# EAGLE design mega_shield_simple (EAGLE 7.6.0)
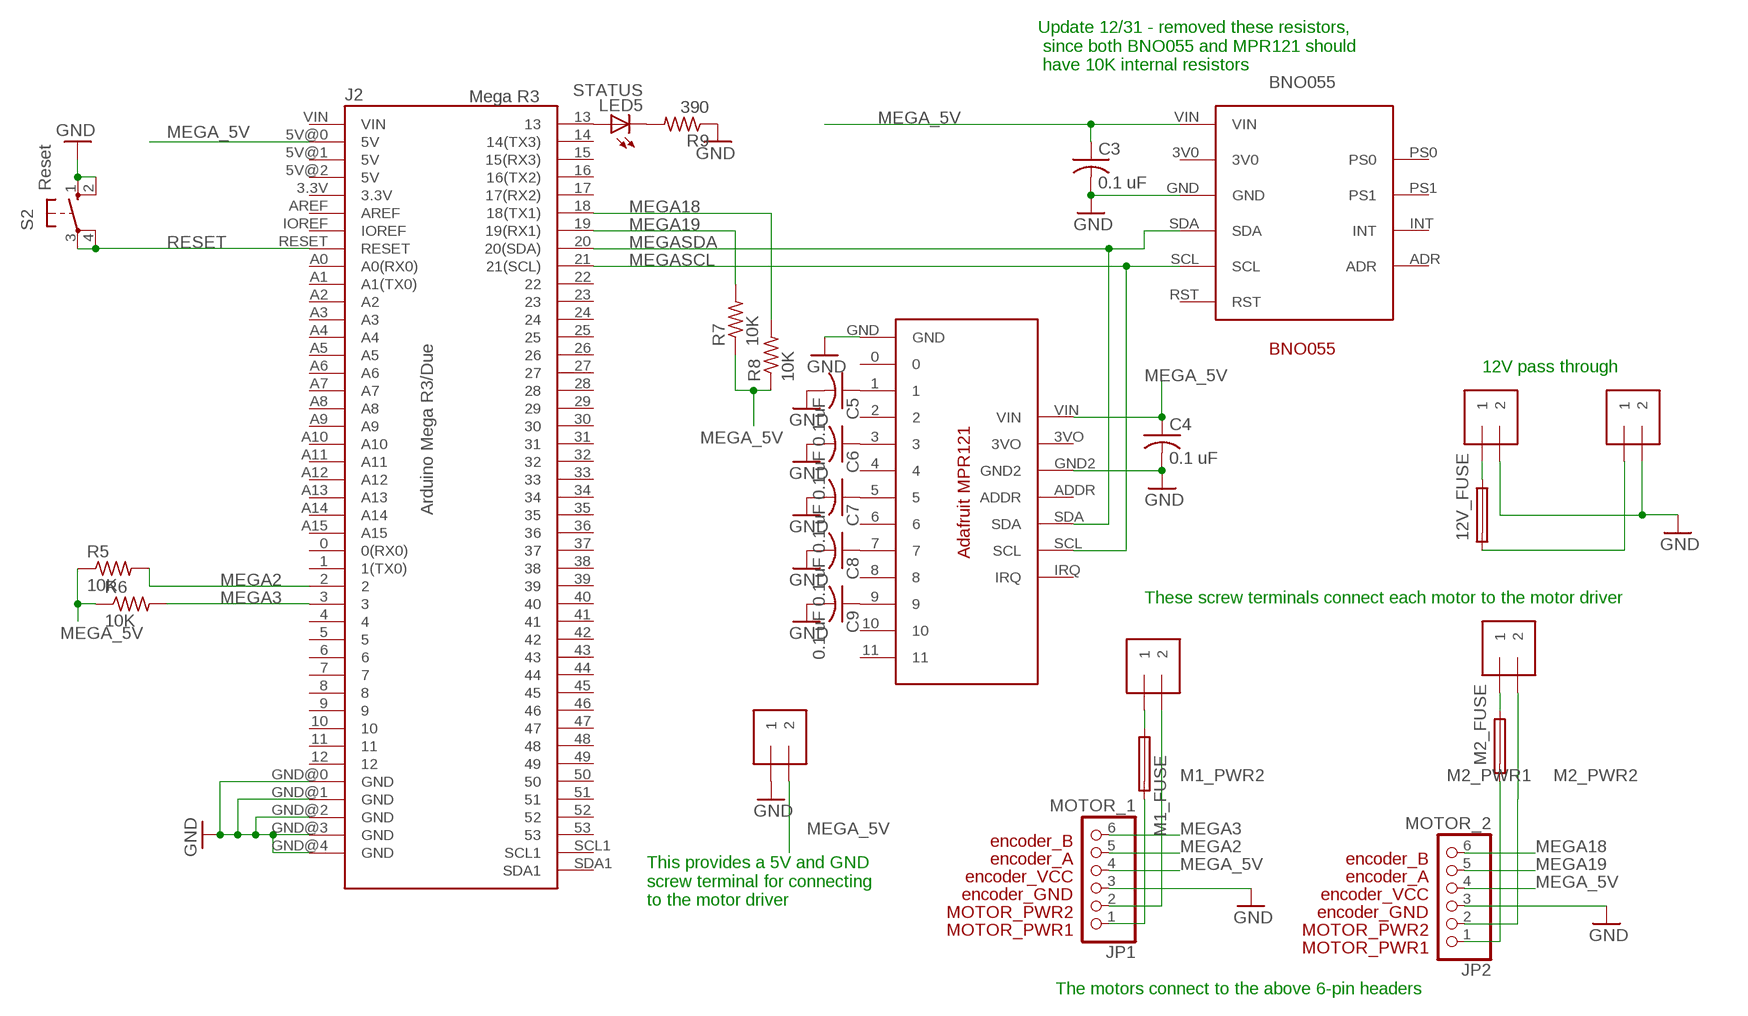
[diagram p0: schematic, sheet 1]

## Parts
5V_OUT  1X2-3.5MM  [1X2-3.5MM]
12V_FUSE  3568  [3568]
12V_PASS1  1X2-3.5MM  [1X2-3.5MM]
12V_PASS2  1X2-3.5MM  [1X2-3.5MM]
BNO055  BNO055  [BNO055]
C3  0.1 uF  C-US025-050X050  [C025-050X050]
C4  0.1 uF  C-US025-050X050  [C025-050X050]
C5  0.1 uF  C-US025-050X050  [C025-050X050]
C6  0.1 uF  C-US025-050X050  [C025-050X050]
C7  0.1 uF  C-US025-050X050  [C025-050X050]
C8  0.1 uF  C-US025-050X050  [C025-050X050]
C9  0.1 uF  C-US025-050X050  [C025-050X050]
J2  Mega R3  ARDUINO-MEGAFULL  [ARDUINO_MEGA]
JP1  MOTOR_1  PINHD-1X6  [1X06]
JP2  MOTOR_2  PINHD-1X6  [1X06]
LED5  STATUS  LED3MM  [LED3MM]
M1_FUSE  FUSETE5  [TE5]
M1_PWR  1X2-3.5MM  [1X2-3.5MM]
M2_FUSE  FUSETE5  [TE5]
M2_PWR  1X2-3.5MM  [1X2-3.5MM]
MPR121  ADA_MPR121  [ADA_MPR121]
R5  10K  R-US_0207/10  [0207/10]
R6  10K  R-US_0207/10  [0207/10]
R7  10K  R-US_0207/10  [0207/10]
R8  10K  R-US_0207/10  [0207/10]
R9  390  R-US_0207/10  [0207/10]
S2  Reset  10-XX  [B3F-10XX]

## Nets
12V_PASSTHRU1: 12V_FUSE.1 12V_FUSE.2 12V_PASS2.1
12V_PASSTHRU2: 12V_FUSE.3 12V_FUSE.4 12V_PASS1.1
GND: 5V_OUT.1 12V_PASS1.2 12V_PASS2.2 BNO055.GND C3.2 C4.2 C5.2 C6.2 C7.2 C8.2 C9.2 J2.GND@0(GND) J2.GND@1(GND) J2.GND@2(GND) J2.GND@3(GND) J2.GND@4(GND) JP1.3 JP2.3 MPR121.GND MPR121.GND2 R9.1 S2.1(S) S2.2(S1)
M1_PWR1 [12V_PWR]: JP1.1 M1_FUSE.2
M1_PWR2 [12V_PWR]: JP1.2 M1_PWR.2
M2_PWR1 [12V_PWR]: JP2.1 M2_FUSE.2
M2_PWR2 [12V_PWR]: JP2.2 M2_PWR.2
MEGA2: J2.2 JP1.5 R5.2
MEGA3: J2.3 JP1.6 R6.2
MEGA18: J2.18(18(TX1)) JP2.6 R8.2
MEGA19: J2.19(19(RX1)) JP2.5 R7.2
MEGA_5V [5V_LDO]: 5V_OUT.2 BNO055.VIN C3.1 C4.1 J2.5V@0(5V) JP1.4 JP2.4 MPR121.VIN R5.1 R6.1 R7.1 R8.1
MEGASCL: BNO055.SCL J2.21(21(SCL)) MPR121.SCL
MEGASDA: BNO055.SDA J2.20(20(SDA)) MPR121.SDA
N$1: C5.1 MPR121.1
N$2: C6.1 MPR121.3
N$3: J2.13 LED5.A
N$4: LED5.K(C) R9.2
N$5: C7.1 MPR121.5
N$6: C8.1 MPR121.7
N$7: M2_FUSE.1 M2_PWR.1
N$8: C9.1 MPR121.9
N$9: M1_FUSE.1 M1_PWR.1
RESET: J2.RESET S2.3(P) S2.4(P1)
Unconnected: BNO055.3V0 BNO055.ADR BNO055.INT BNO055.PS0 BNO055.PS1 BNO055.RST J2.0(0(RX0)) J2.1(1(TX0)) J2.3.3V J2.4 J2.5 J2.5V@1(5V) J2.5V@2(5V) J2.6 J2.7 J2.8 J2.9 J2.10 J2.11 J2.12 J2.14(14(TX3)) J2.15(15(RX3)) J2.16(16(TX2)) J2.17(17(RX2)) J2.22 J2.23 J2.24 J2.25 J2.26 J2.27 J2.28 J2.29 J2.30 J2.31 J2.32 J2.33 J2.34 J2.35 J2.36 J2.37 J2.38 J2.39 J2.40 J2.41 J2.42 J2.43 J2.44 J2.45 J2.46 J2.47 J2.48 J2.49 J2.50 J2.51 J2.52 J2.53 J2.A0(A0(RX0)) J2.A1(A1(TX0)) J2.A2 J2.A3 J2.A4 J2.A5 J2.A6 J2.A7 J2.A8 J2.A9 J2.A10 J2.A11 J2.A12 J2.A13 J2.A14 J2.A15 J2.AREF J2.IOREF J2.SCL1 J2.SDA1 J2.VIN MPR121.0 MPR121.2 MPR121.3VO MPR121.4 MPR121.6 MPR121.8 MPR121.10 MPR121.11 MPR121.ADDR MPR121.IRQ

## Notes on the sheet
- Update 12/31 - removed these resistors,
   since both BNO055 and MPR121 should
   have 10K internal resistors
- 12V pass through
- Arduino Mega R3/Due
- These screw terminals connect each motor to the motor driver
- This provides a 5V and GND 
  screw terminal for connecting
  to the motor driver
- The motors connect to the above 6-pin headers

## Library data of the parts
5V_OUT 12V_PASS1 12V_PASS2 M1_PWR M2_PWR = adafruit:1X2: 3.5mm Terminal block http://www.ladyada.net/library/pcb/eaglelibrary.html
12V_FUSE = keystone:3568: Mini ATC Fuse Holder 20A 500V 1 Circuit Blade PCB
BNO055 = arduinoShield:BNO055
C3-C9 = rcl:C-US: CAPACITOR, American symbol
J2 = zortness:ARDUINO-MEGA: Arduino MegaR3 board footprint. Also works for Due.
JP1 JP2 = adafruit:PINHD-1X6: PIN HEADER
LED5 = adafruit:LED: LED OSRAM: - CHIPLED LG R971, LG N971, LY N971, LG Q971, LY Q971, LO R971, LY R971 LH N974, LH R974 LS Q976, LO Q976, LY Q976 LO Q996 - Hyper CHIPLED LW Q18S LB Q993, LB Q99A, LB R99A - SideLED LS A670, LO A670, LY A670, LG A670, LP A670 LB A673, LV A673, LT A673, LW A673 LH A674 LY A675 LS A676, LA A676, LO A676, LY A676, LW A676 LS A679, LY A679, LG A679 - Hyper Micro SIDELED® LS Y876, LA Y876, LO Y876, LY Y876 LT Y87S - SmartLED LW L88C, LW L88S LB L89C, LB L89S, LG L890 LS L89K, LO L89K, LY L89K LS L896, LA L896, LO L896, LY L896 - TOPLED LS T670, LO T670, LY T670, LG T670, LP T670 LSG T670, LSP T670, LSY T670, LOP T670, LYG T670 LG T671, LOG T671, LSG T671 LB T673, LV T673, LT T673, LW T673 LH T674 LS T676, LA T676, LO T676, LY T676, LB T676, LH T676, LSB T676, LW T676 LB T67C, LV T67C, LT T67C, LS T67K, LO T67K, LY T67K, LW E67C LS E67B, LA E67B, LO E67B, LY E67B, LB E67C, LV E67C, LT E67C LW T67C LS T679, LY T679, LG T679 LS T770, LO T770, LY T770, LG T770, LP T770 LB T773, LV T773, LT T773, LW T773 LH T774 LS E675, LA E675, LY E675, LS T675 LS T776, LA T776, LO T776, LY T776, LB T776 LHGB T686 LT T68C, LB T68C - Hyper Mini TOPLED® LB M676 - Mini TOPLED Santana® LG M470 LS M47K, LO M47K, LY M47K Source: http://www.osram.convergy.de/
M1_FUSE M2_FUSE = fuse:FUSE: Fuse; OC_FARNELL: unknown; OC_NEWARK: unknown
MPR121 = arduinoShield:ADA_MPR121
R5-R9 = rcl:R-US_: RESISTOR, American symbol
S2 = switch-omron:10-XX: OMRON SWITCH; MPN: B3F-1000; OC_FARNELL: 176432; OC_NEWARK: 36M3542

## Net classes
1 12V_PWR: width 1.778 mm
2 5V_LDO: width 0.305 mm

## Board
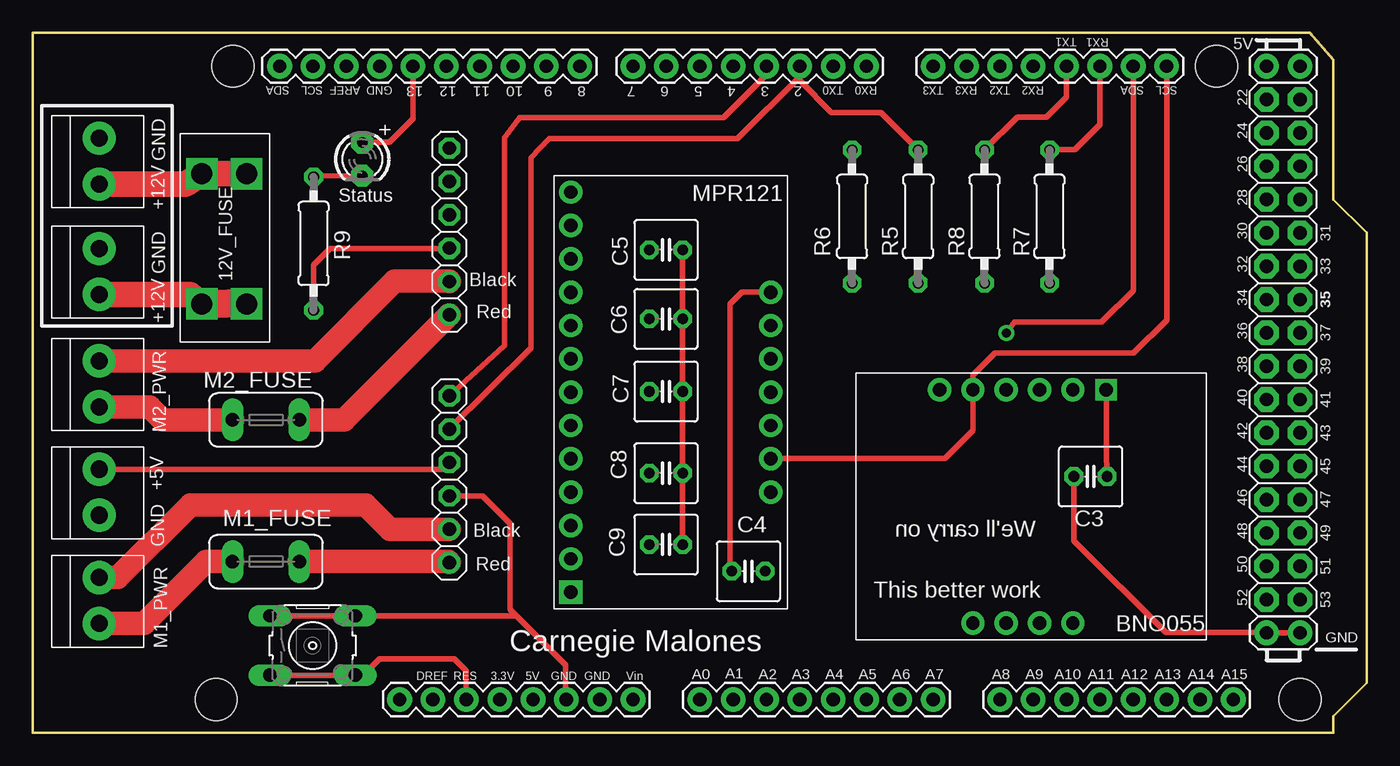
[diagram p1: board, top side]
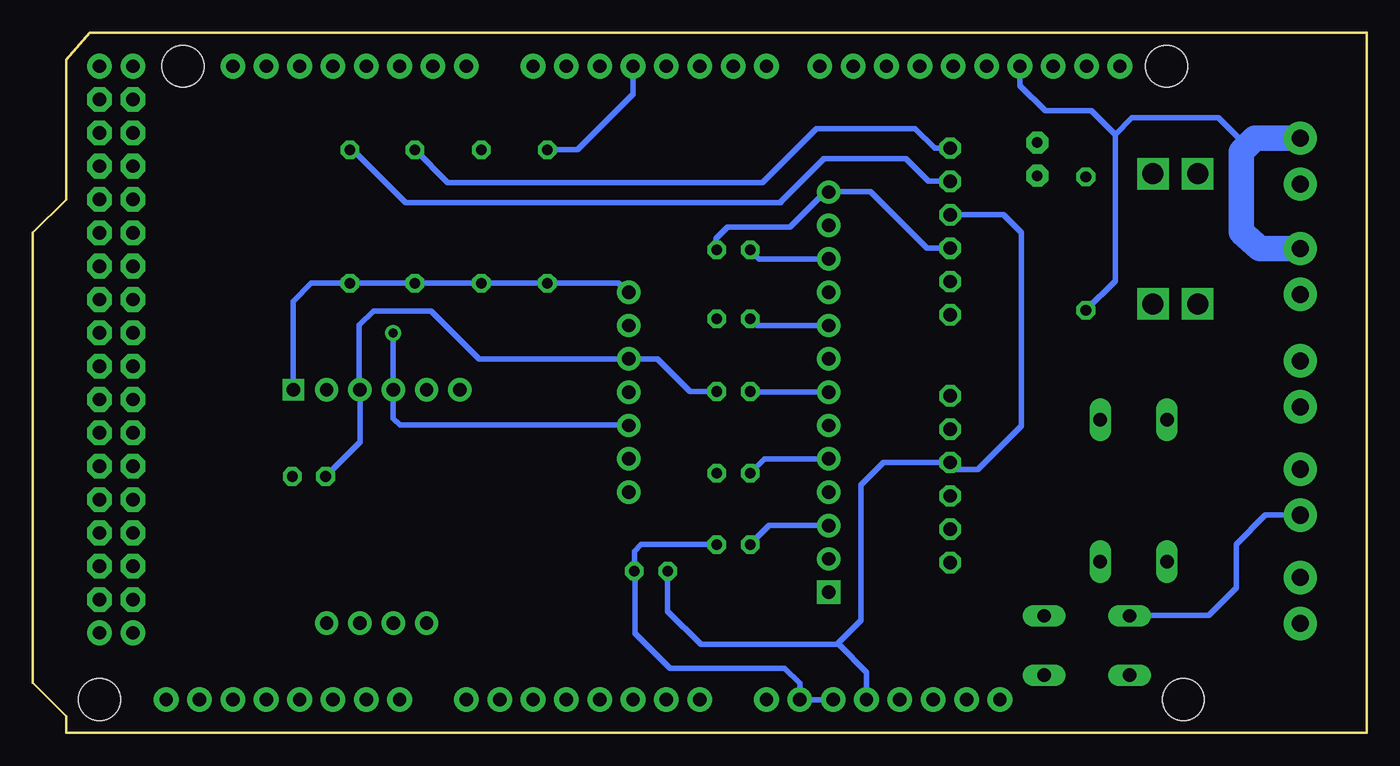
[diagram p2: board, bottom side, seen from below]

Size 101.6 x 53.34 mm. Coordinates in mm from the lower left corner, seen from the top.
Copper layers (1*16): Top 0.035mm / dielectric 1.5mm / Bottom 0.035mm
Design rules "SparkFun": minimum track width 8mil, minimum drill 20mil, track to track 8mil, track to pad 8mil, pad to pad 8mil, via to via 8mil, smd to smd 8mil, copper to edge 10mil, drill to drill 8mil, minimum pad ring 12mil, minimum via ring 10mil, stop-mask expansion 4mil, vias tented up to drill 25mil, thermal gap 10mil

### Footprints (pad centres in the part's own frame; a part is rotated, then mirrored left to right if it is on the bottom)
1X2-3.5MM = drill 1.3 pad 2.54: 1 1.8,0; 2 -1.7,0
3568 = drill 1.6 square: 1 -4.953,1.702; 2 -4.953,-1.702; 3 4.953,1.702; 4 4.953,-1.702
BNO055 = drill 1.016 pad 1.778: 3V0 1.27,-10.16; ADR 19.05,-17.78; GND 1.27,-12.7; INT 19.05,-15.24; PS0 19.05,-10.16; PS1 19.05,-12.7; RST 1.27,-20.32; SCL 1.27,-17.78; SDA 1.27,-15.24 | drill 1.016 square: VIN 1.27,-7.62
C025-050X050 = drill 0.813 octagon: 1 -1.27,0; 2 1.27,0
ARDUINO_MEGA = drill 1.016 pad 1.88: 0 63.5,50.8; 1 60.96,50.8; 2 58.42,50.8; 3 55.88,50.8; 3.3V 35.56,2.54; 4 53.34,50.8; 5 50.8,50.8; 5V@0 38.1,2.54; 5V@1 93.98,50.8; 5V@2 96.52,50.8; 6 48.26,50.8; 7 45.72,50.8; 8 41.656,50.8; 9 39.116,50.8; 10 36.576,50.8; 11 34.036,50.8; 12 31.496,50.8; 13 28.956,50.8; 14 68.58,50.8; 15 71.12,50.8; 16 73.66,50.8; 17 76.2,50.8; 18 78.74,50.8; 19 81.28,50.8; 20 83.82,50.8; 21 86.36,50.8; A0 50.8,2.54; A1 53.34,2.54; A2 55.88,2.54; A3 58.42,2.54; A4 60.96,2.54; A5 63.5,2.54; A6 66.04,2.54; A7 68.58,2.54; A8 73.66,2.54; A9 76.2,2.54; A10 78.74,2.54; A11 81.28,2.54; A12 83.82,2.54; A13 86.36,2.54; A14 88.9,2.54; A15 91.44,2.54; AREF 23.876,50.8; EMPTY 27.94,2.54; GND@0 40.64,2.54; GND@1 43.18,2.54; GND@2 93.98,7.62; GND@3 96.52,7.62; GND@4 26.416,50.8; IOREF 30.48,2.54; RESET 33.02,2.54; SCL1 21.336,50.8; SDA1 18.796,50.8; VIN 45.72,2.54 | drill 1.016 pad 1.88 octagon: 22 93.98,48.26; 23 96.52,48.26; 24 93.98,45.72; 25 96.52,45.72; 26 93.98,43.18; 27 96.52,43.18; 28 93.98,40.64; 29 96.52,40.64; 30 93.98,38.1; 31 96.52,38.1; 32 93.98,35.56; 33 96.52,35.56; 34 93.98,33.02; 35 96.52,33.02; 36 93.98,30.48; 37 96.52,30.48; 38 93.98,27.94; 39 96.52,27.94; 40 93.98,25.4; 41 96.52,25.4; 42 93.98,22.86; 43 96.52,22.86; 44 93.98,20.32; 45 96.52,20.32; 46 93.98,17.78; 47 96.52,17.78; 48 93.98,15.24; 49 96.52,15.24; 50 93.98,12.7; 51 96.52,12.7; 52 93.98,10.16; 53 96.52,10.16 | hole 3.2: 15.24,50.8; 13.97,2.54; 90.17,50.8; 96.52,2.54
1X06 = drill 1.016 octagon: 1 -6.35,0; 2 -3.81,0; 3 -1.27,0; 4 1.27,0; 5 3.81,0; 6 6.35,0
LED3MM = drill 0.813 pad 1.676 octagon: A -1.27,0; K 1.27,0
TE5 = drill 1.016 long: 1 -2.54,0; 2 2.54,0
ADA_MPR121 = drill 1.016 pad 1.778: 0 0,-2.54; 1 0,-5.08; 2 0,-7.62; 3 0,-10.16; 3VO 15.24,-10.16; 4 0,-12.7; 5 0,-15.24; 6 0,-17.78; 7 0,-20.32; 8 0,-22.86; 9 0,-25.4; 10 0,-27.94; ADDR 15.24,-15.24; GND 0,0; GND2 15.24,-12.7; IRQ 15.24,-22.86; SCL 15.24,-20.32; SDA 15.24,-17.78; VIN 15.24,-7.62 | drill 1.016 pad 1.778 square: 11 0,-30.48
0207/10 = drill 0.813 octagon: 1 -5.08,0; 2 5.08,0
B3F-10XX = drill 1.016 long: 1 -3.251,2.261; 2 3.251,2.261; 3 -3.251,-2.261; 4 3.251,-2.261

### Placement (x,y rotation side)
5V_OUT  5.05,18.39 270 top
12V_FUSE  14.58,37.64 90 top
12V_PASS1  5.05,43.61 270 top
12V_PASS2  5.05,35.2 270 top
BNO055  89.38,27.41 270 top
C3  80.57,19.53 180 top
C4  54.51,12.32 0 top
C5  48.23,36.8 0 top
C6  48.23,31.55 0 top
C7  48.23,26.01 0 top
C8  48.23,19.79 0 top
C9  48.23,14.35 0 top
J2  0,0 0 top
JP1  31.72,19.33 90 top
JP2  31.72,38.2 90 top
LED5  25.1,43.71 270 top
M1_FUSE  17.75,13.06 0 top
M1_PWR  5.05,10.13 270 top
M2_FUSE  17.75,23.85 0 top
M2_PWR  5.05,26.64 270 top
MPR121  40.97,41.2 0 top
R5  67.44,39.34 90 top
R6  62.41,39.34 90 top
R7  77.44,39.34 90 top
R8  72.49,39.34 90 top
R9  21.39,37.29 90 top
S2  21.31,6.65 0 top

### Tracks (layer width: path | path; a pad name or v marks a point on that pad's centre or on a via)
12V_PASSTHRU1
  Top 1.93: 12V_PASS2.1 11.99,33.4 12V_FUSE.1
  Top 2.184: 12V_FUSE.1 13.81,32.67 15.8,32.74 12V_FUSE.2
12V_PASSTHRU2
  Top 1.93: 12V_PASS1.1 11.66,41.81 12V_FUSE.3 12V_FUSE.4
GND
  Top 0.406: C3.2 79.3,14.63 86.28,7.65 93.95,7.65 J2.GND@2 J2.GND@3 | C5.2 C6.2 C7.2 C8.2 C9.2 | 36.83,8.92 S2.2 S2.1 | 36.83,8.92 40.56,5.18 40.56,2.62 J2.GND@0 | R9.1 21.39,35.66 22.63,36.91 31.7,36.91 JP2.3 | JP1.3 34.24,18.06 36.35,15.95 36.35,9.4 36.83,8.92
  Bottom 0.406: C3.2 76.68,22.15 BNO055.GND 76.73,26.19 76.73,31.06 75.64,32.16 71.27,32.16 67.61,28.5 MPR121.GND2 56.18,28.47 54,28.47 51.54,26.01 C7.2 | C9.2 55.27,14.35 55.78,13.84 C4.2 55.73,12.27 55.73,7.59 53.06,4.93 44.35,4.93 43.18,3.76 J2.GND@1 J2.GND@0 | C5.2 49.56,36.86 49.56,37.67 48.69,38.53 43.94,38.53 41.27,41.2 MPR121.GND 40.94,41.22 37.8,41.22 33.5,36.93 JP2.3 | 5V_OUT.1 7.72,16.59 9.93,14.38 9.93,11.05 12.04,8.94 18.62,8.94 18.64,8.92 S2.1 | J2.GND@4 26.42,49.33 24.49,47.4 20.95,47.4 19.15,45.59 | 19.15,45.59 19.15,34.44 R9.1 | 9.55,44.27 9.55,45.11 11.3,46.86 17.88,46.86 19.15,45.59
  Bottom 1.93: 12V_PASS1.2 8.51,45.31 9.55,44.27 9.55,38.15 8.15,36.91 5.54,36.91 12V_PASS2.2
M1_PWR1
  Top 1.778: M1_FUSE.2 31.65,13.06 JP1.1
M1_PWR2
  Top 1.778: M1_PWR.2 6.48,11.83 12.01,17.37 25.35,17.37 27.2,15.52 JP1.2
M2_PWR1
  Top 1.778: M2_FUSE.2 23.72,23.85 JP2.1
M2_PWR2
  Top 1.778: M2_PWR.2 21.49,28.34 27.56,34.42 31.7,34.42 JP2.2
MEGA2
  Top 0.406: J2.2 58.42,50.01 | 58.42,50.01 58.42,49.68 60.83,47.27 64.59,47.27 R5.2 | 58.42,50.01 53.67,45.26 39.32,45.26 37.95,43.84 37.95,29.31 JP1.5
MEGA3
  Top 0.406: J2.3 55.88,50.14 52.6,46.86 37.08,46.86 35.92,45.34 35.92,29.51 JP1.6
  Bottom 0.406: J2.3 55.88,48.67 60.12,44.42 R6.2
MEGA18
  Top 0.406: J2.18 78.74,48.44 77.22,46.91 74.98,46.91 R8.2
  Bottom 0.406: R8.2 70,41.94 46.02,41.94 41.91,46.05 34.39,46.05 32.89,44.55 JP2.6
MEGA19
  Top 0.406: J2.19 81.28,46.33 79.37,44.42 R7.2
  Bottom 0.406: R7.2 77.24,44.42 73.2,40.39 44.63,40.39 44.63,40.49 41.35,43.76 35.1,43.76 33.38,42.04 31.75,42.04 JP2.5
MEGA_5V
  Top 0.406: BNO055.VIN 81.76,20.93 C3.1 | MPR121.VIN 54,33.58 53.09,32.66 53.09,12.47 C4.1 | 5V_OUT.2 31.21,20.09 JP1.4
  Bottom 0.406: BNO055.VIN 81.79,26.16 81.79,32.87 80.39,34.26 R7.1 R8.1 R5.1 R6.1 57,34.26 56.31,33.58 MPR121.VIN | C4.1 53.24,9.25 50.72,6.73 40.36,6.73 | 40.36,6.73 40.21,6.73 38.1,4.62 J2.5V@0 | 40.36,6.73 38.51,8.59 38.51,18.9 36.8,20.6 JP1.4 31.21,20.09 29.62,20.09 26.31,23.39 26.31,38.1 27.69,39.47 JP2.4
MEGASCL
  Top 0.406: J2.21 86.36,31.45 83.85,28.93 73.28,28.93 71.6,27.25 BNO055.SCL 71.6,23.04 69.47,20.9 56.24,20.9 MPR121.SCL
MEGASDA  (via drill 0.7)
  Top 0.406: J2.20 83.82,33.71 81.41,31.29 74.78,31.29 v74.17,30.45
  Bottom 0.406: v74.17,30.45 74.17,26.16 BNO055.SDA 74.14,23.95 73.63,23.44 56.24,23.44 MPR121.SDA
N$1
  Bottom 0.406: MPR121.1 46.28,36.12 C5.1
N$2
  Bottom 0.406: MPR121.3 46.46,31.04 C6.1
N$3
  Top 0.406: J2.13 28.96,46.79 27.18,45.01 25.12,45.01 LED5.A
N$4
  Top 0.406: LED5.K 21.34,42.42 R9.2
N$5
  Bottom 0.406: MPR121.5 46.91,25.96 C7.1
N$6
  Bottom 0.406: MPR121.7 45.87,20.88 C8.1
N$7
  Top 1.778: M2_PWR.1 8.89,24.84 9.88,23.85 M2_FUSE.1
N$8
  Bottom 0.406: MPR121.9 45.52,15.8 C9.1
N$9
  Top 1.778: M1_PWR.1 8.49,8.33 13.21,13.06 M1_FUSE.1
RESET
  Top 0.406: S2.3 S2.4 25.17,4.39 26.42,5.64 32.11,5.64 33.02,4.72 J2.RESET

### Text on the board
tNames: GND | +12V | Status | GND | +12V | Black | Red | +5V | GND | Black | We'll carry on | Red | This better work | Carnegie Malones